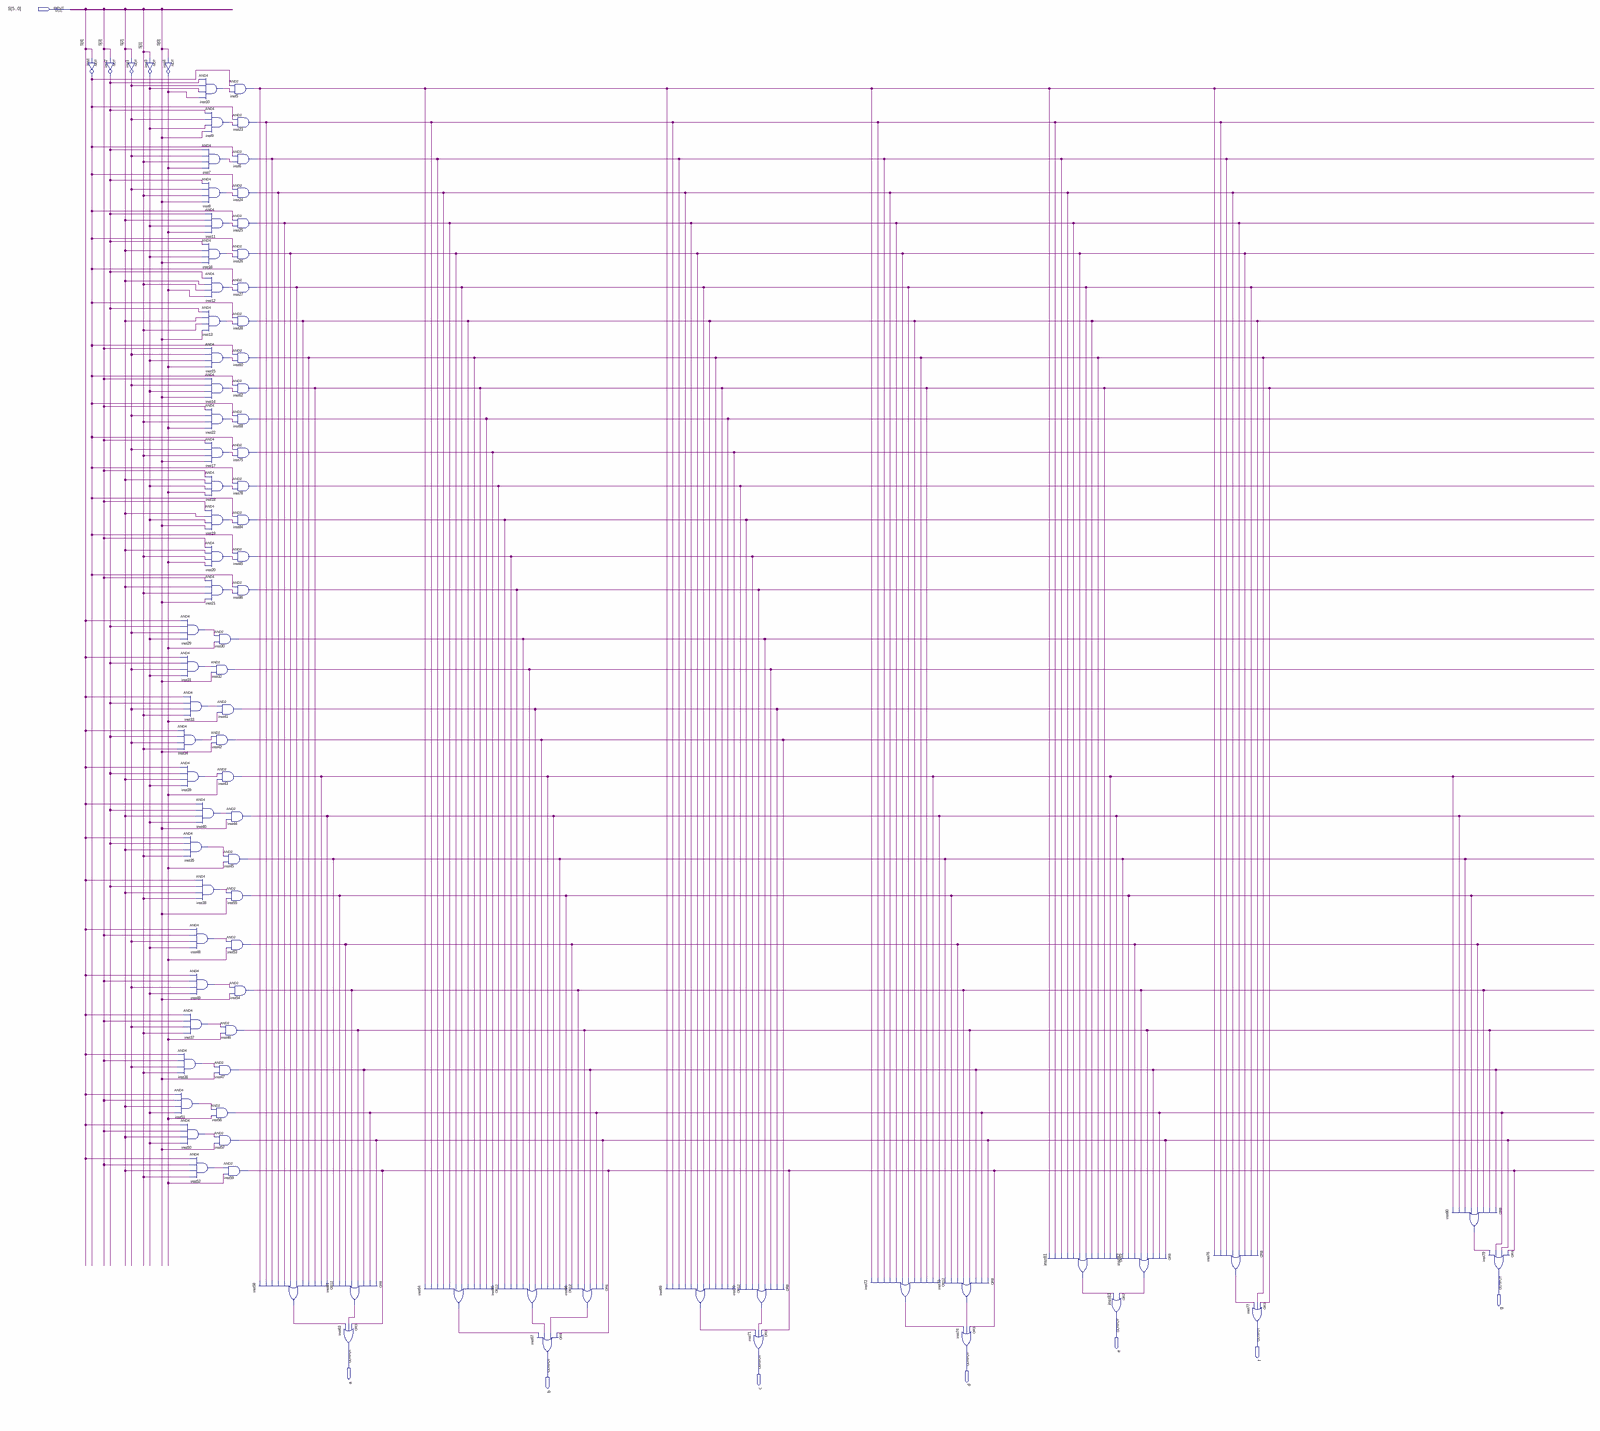
[diagram p0: schematic sheet, whole]
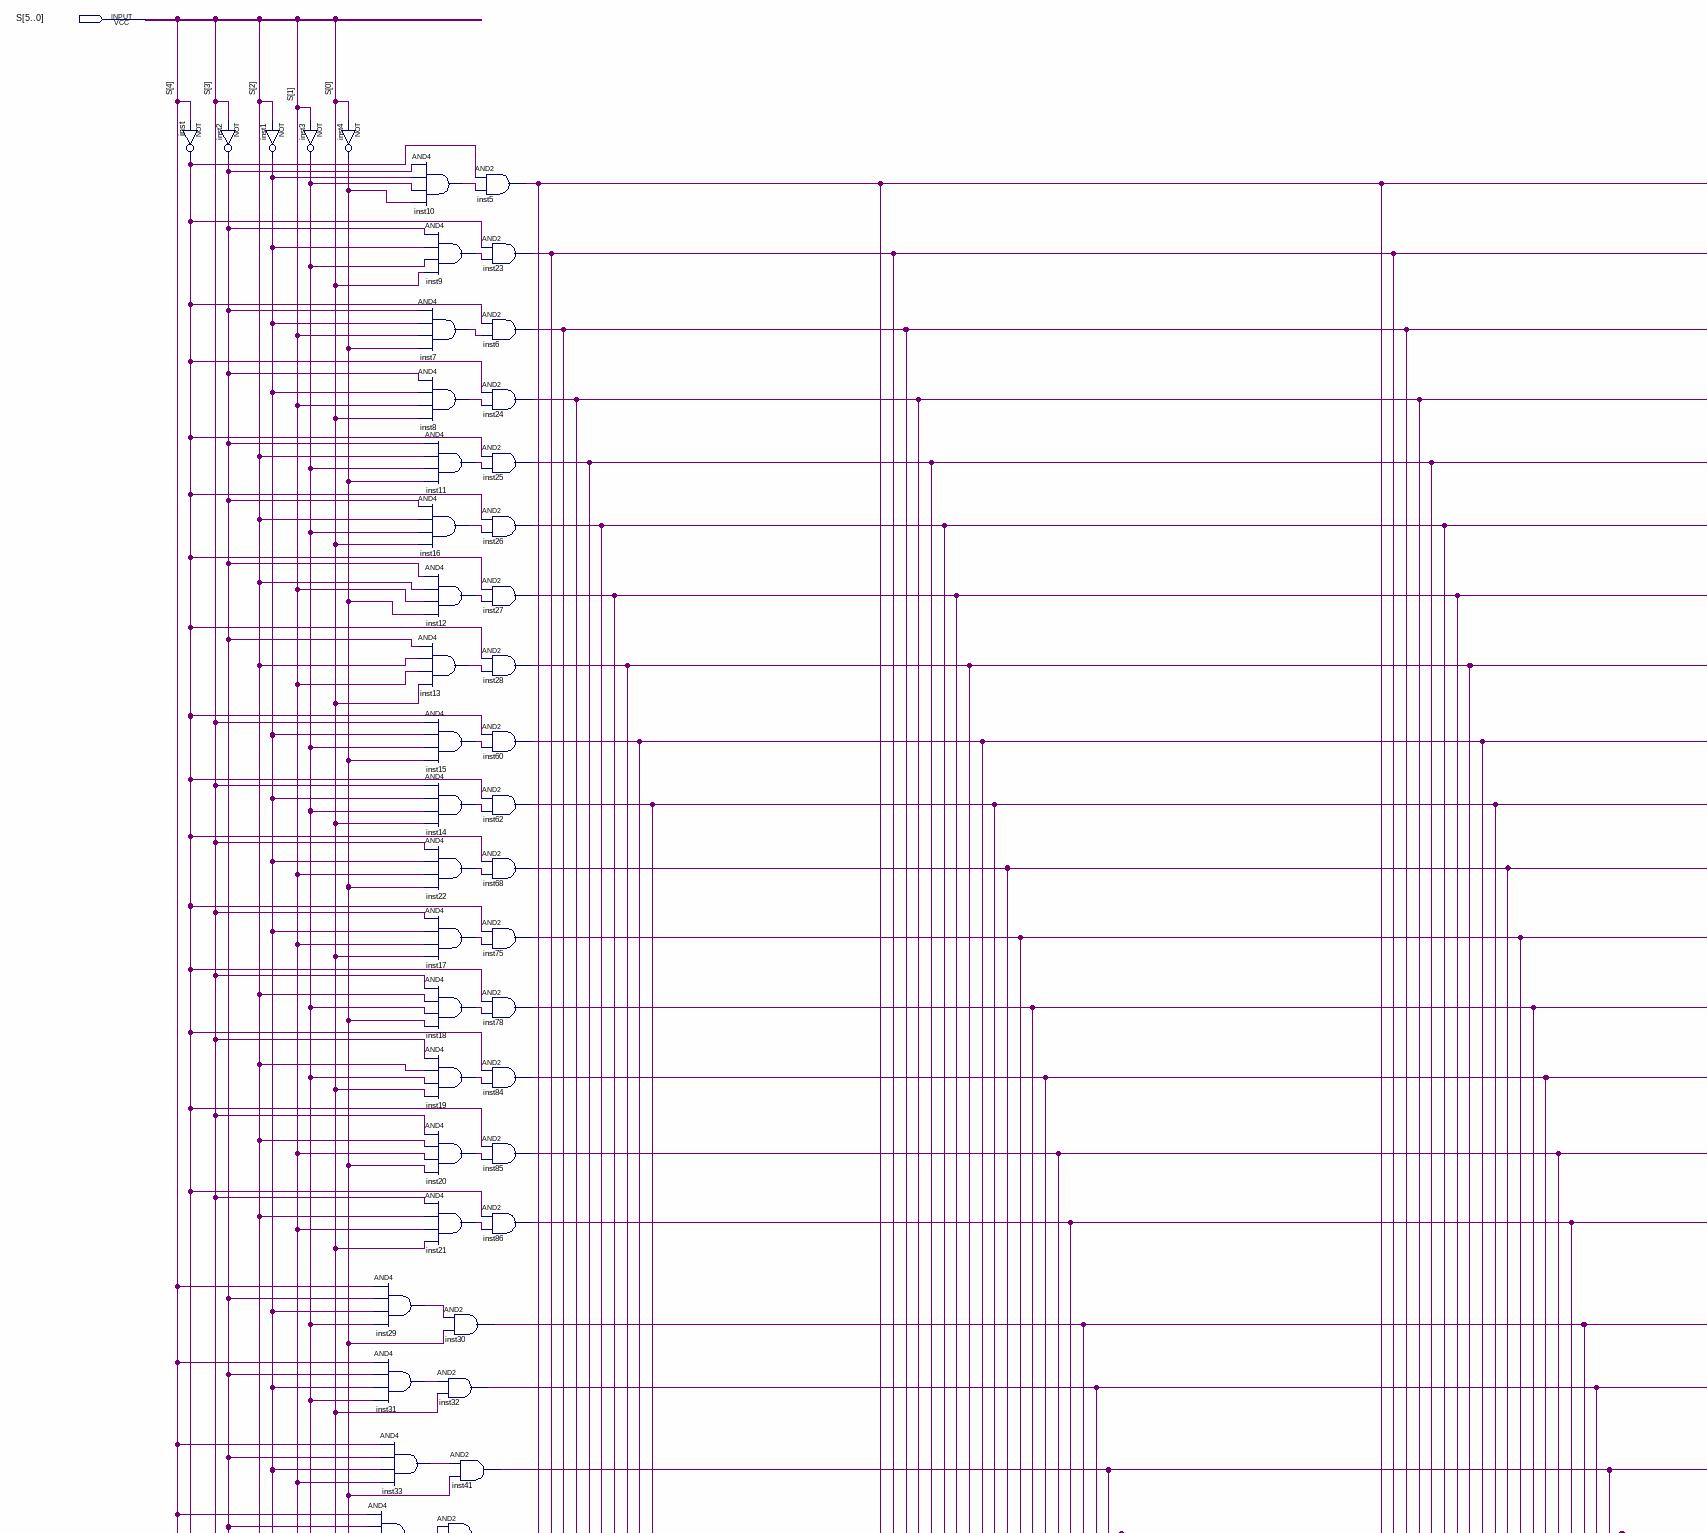
[diagram p1: schematic sheet, upper left part]
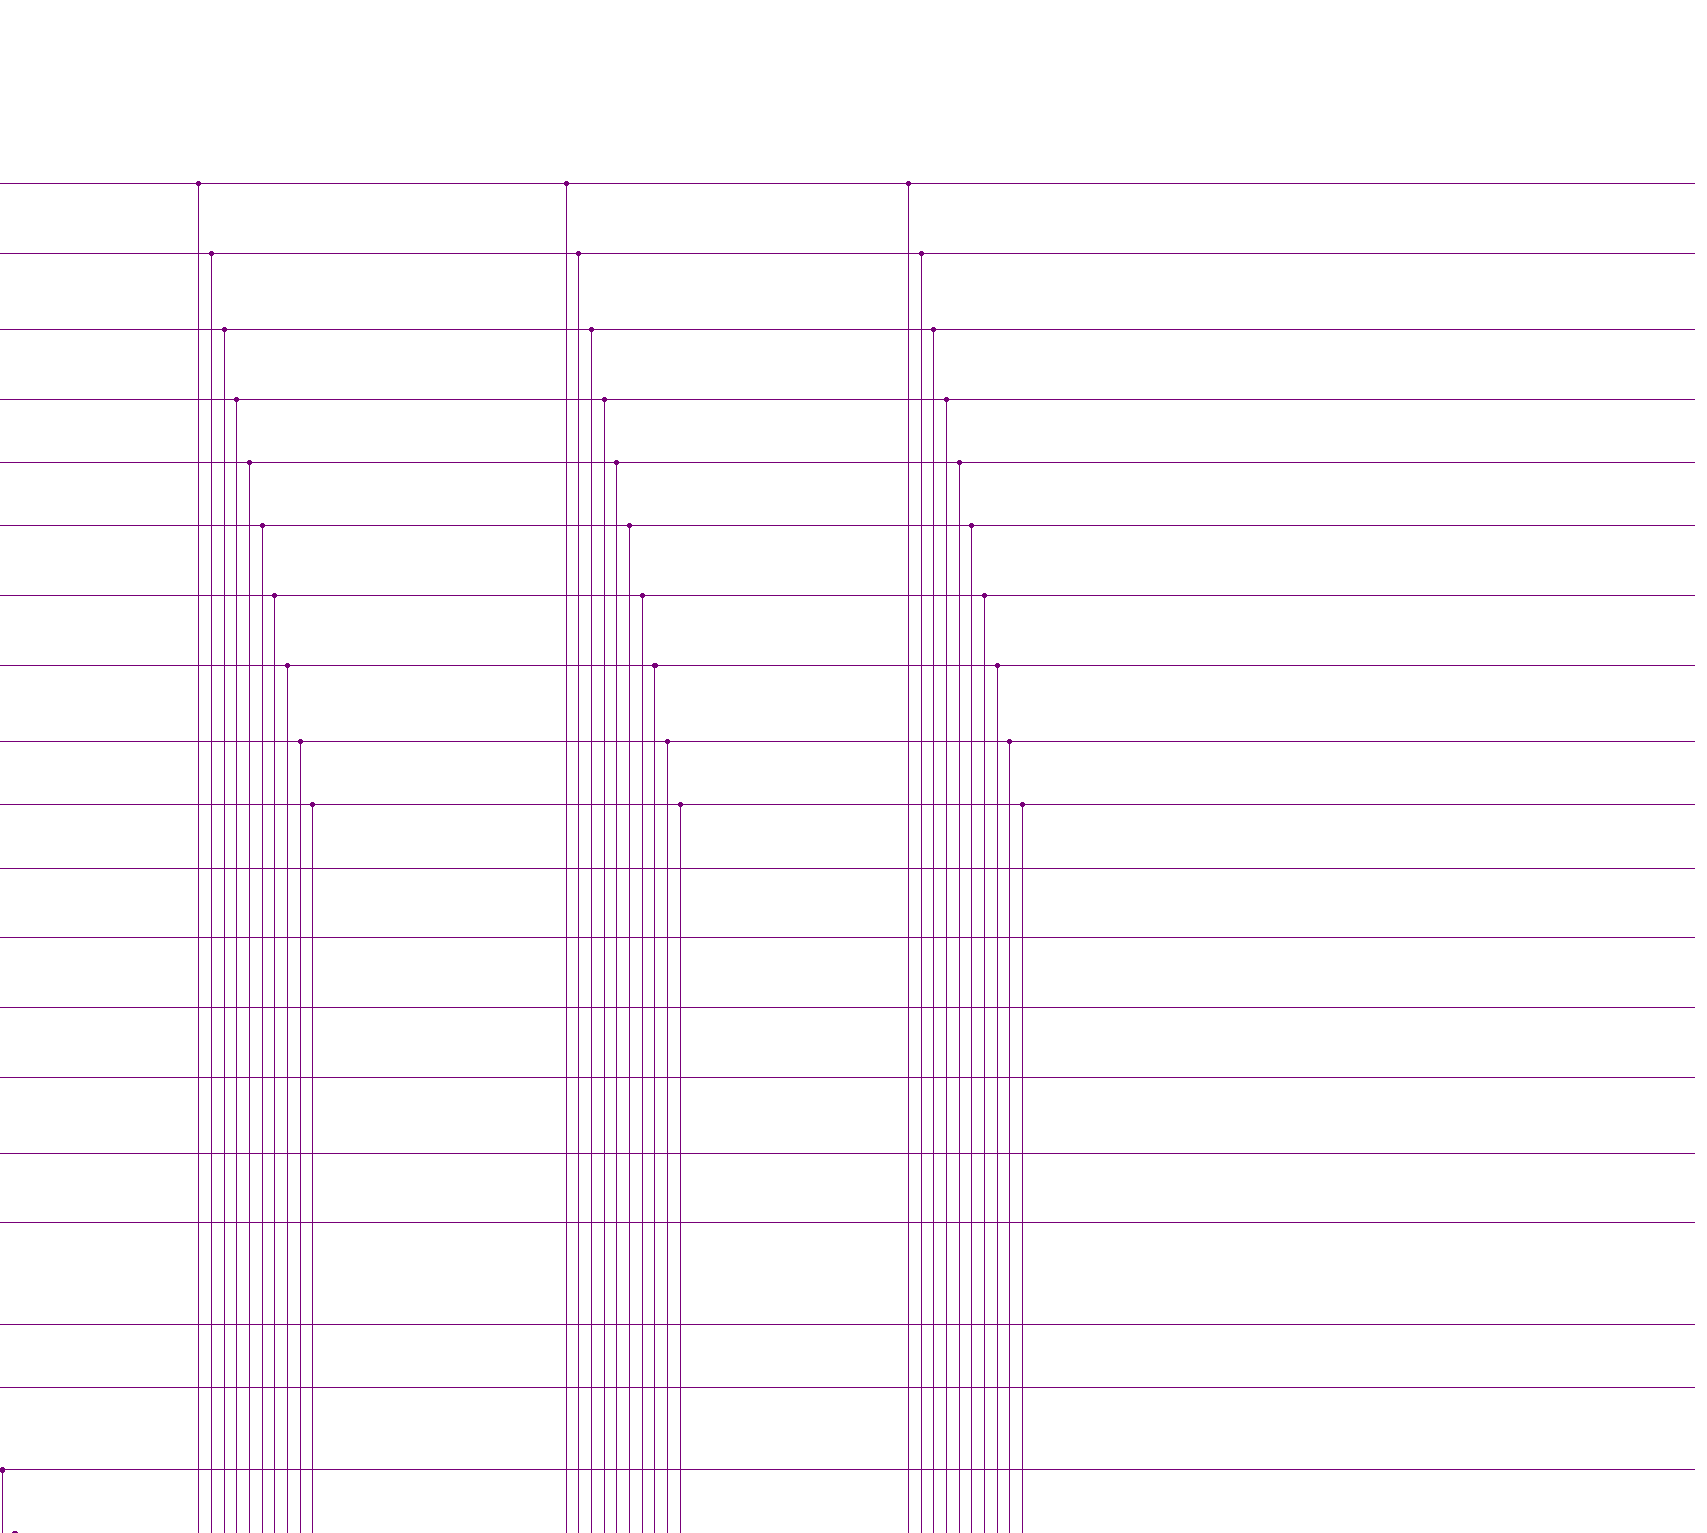
[diagram p2: schematic sheet, upper right part]
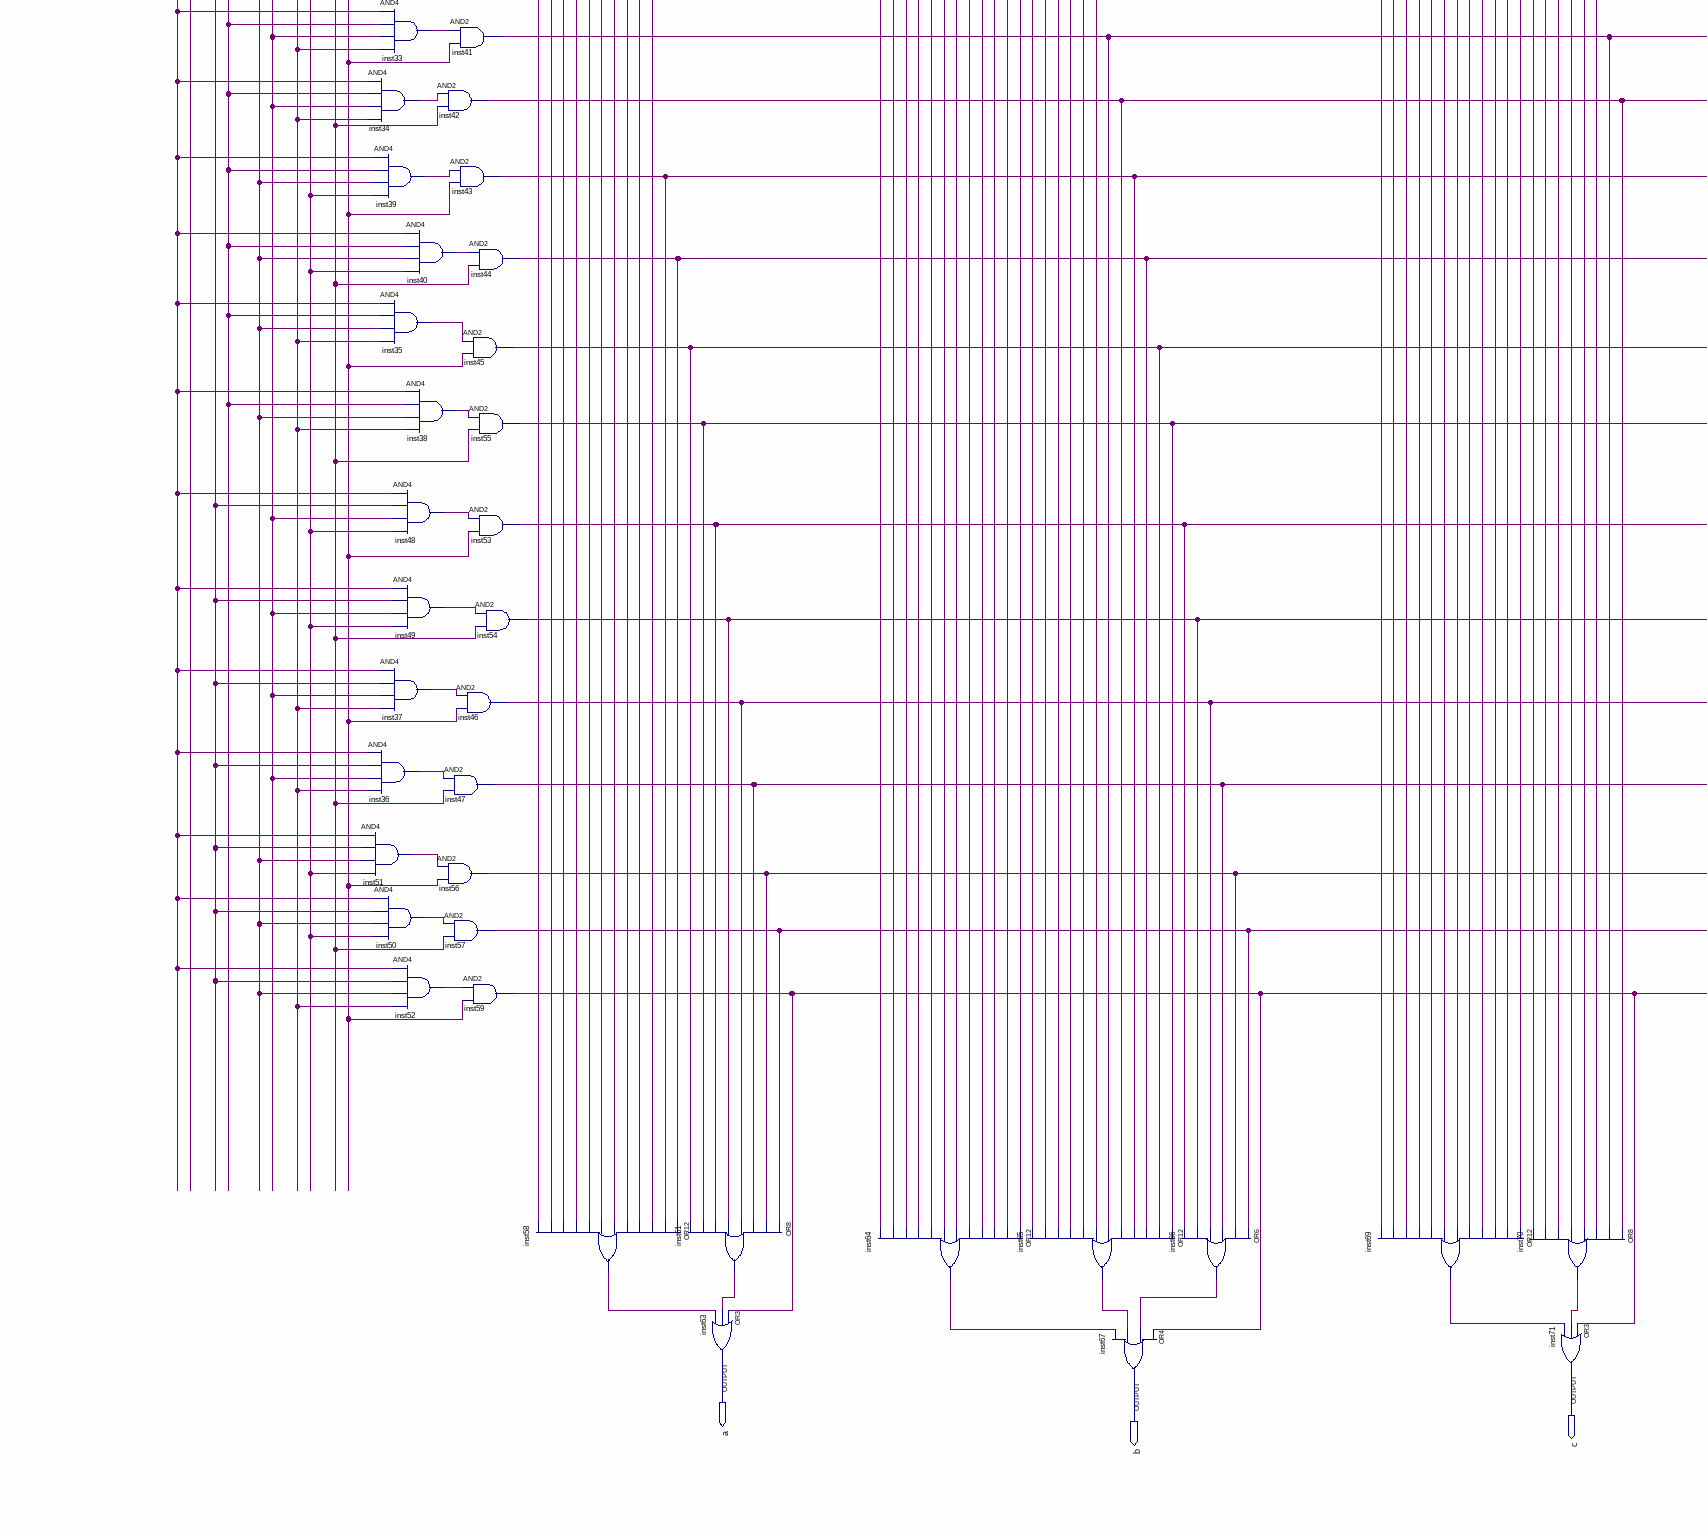
[diagram p3: schematic sheet, lower left part]
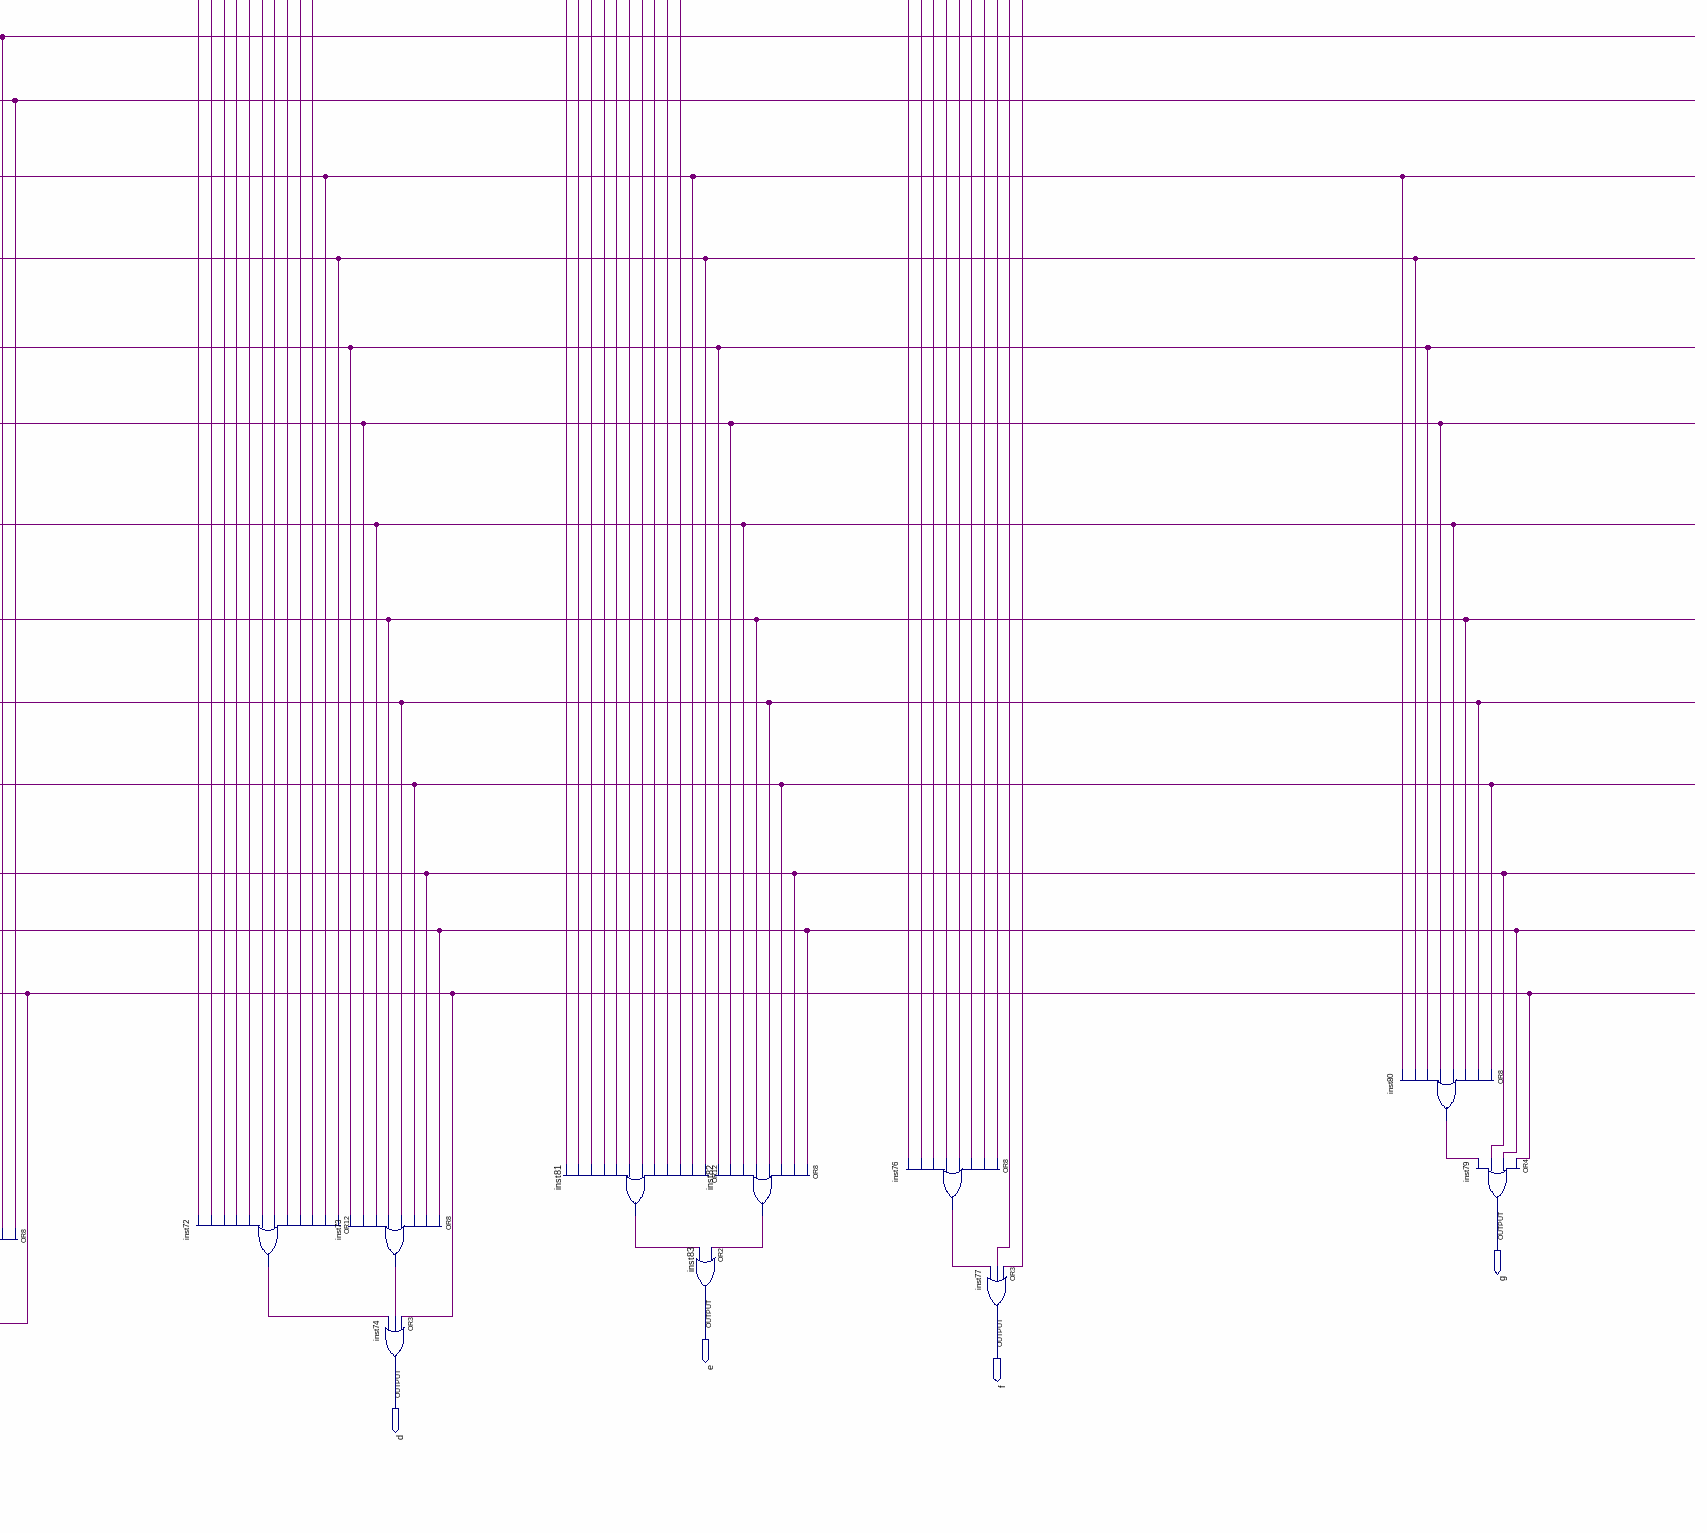
[diagram p4: schematic sheet, lower right part]
// Quartus schematic decodificadorEsquerdoOK.bdf as structural Verilog: 87 symbols, 8 pins
module decodificadorEsquerdoOK (
  input  [5:0] S,
  output g,
  output e,
  output f,
  output a,
  output d,
  output c,
  output b
);

  wire inst1_out, inst2_out, inst3_out, inst4_out, inst5_out, inst6_out, inst7_out, inst8_out, inst9_out,
       inst10_out, inst11_out, inst12_out, inst13_out, inst14_out, inst15_out, inst16_out, inst17_out,
       inst18_out, inst19_out, inst20_out, inst21_out, inst22_out, inst23_out, inst24_out, inst25_out,
       inst26_out, inst27_out, inst28_out, inst29_out, inst30_out, inst31_out, inst32_out, inst33_out,
       inst34_out, inst35_out, inst36_out, inst37_out, inst38_out, inst39_out, inst40_out, inst41_out,
       inst42_out, inst43_out, inst44_out, inst45_out, inst46_out, inst47_out, inst48_out, inst49_out,
       inst50_out, inst51_out, inst52_out, inst53_out, inst54_out, inst55_out, inst56_out, inst57_out,
       inst58_out, inst59_out, inst60_out, inst61_out, inst62_out, inst64_out, inst65_out, inst66_out,
       inst68_out, inst69_out, inst70_out, inst72_out, inst73_out, inst75_out, inst76_out, inst78_out,
       inst80_out, inst81_out, inst82_out, inst84_out, inst85_out, inst86_out, inst_out;

  not inst (inst_out, S[4]);
  not inst2 (inst2_out, S[3]);
  not inst1 (inst1_out, S[2]);
  not inst3 (inst3_out, S[1]);
  not inst4 (inst4_out, S[0]);
  and inst29 (inst29_out, S[4], inst2_out, inst1_out, inst3_out);
  and inst31 (inst31_out, S[4], inst2_out, inst1_out, inst3_out);
  and inst33 (inst33_out, S[4], inst2_out, inst1_out, S[1]);
  and inst34 (inst34_out, S[4], inst2_out, inst1_out, S[1]);
  and inst39 (inst39_out, S[4], inst2_out, S[2], inst3_out);
  and inst35 (inst35_out, S[4], inst2_out, S[2], S[1]);
  and inst48 (inst48_out, S[4], S[3], inst1_out, inst3_out);
  and inst49 (inst49_out, S[4], S[3], inst1_out, inst3_out);
  and inst37 (inst37_out, S[4], S[3], inst1_out, S[1]);
  and inst36 (inst36_out, S[4], S[3], inst1_out, S[1]);
  and inst51 (inst51_out, S[4], S[3], S[2], inst3_out);
  and inst50 (inst50_out, S[4], S[3], S[2], inst3_out);
  and inst52 (inst52_out, S[4], S[3], S[2], S[1]);
  and inst10 (inst10_out, inst2_out, inst1_out, inst3_out, inst4_out);
  and inst9 (inst9_out, inst2_out, inst1_out, inst3_out, S[0]);
  and inst7 (inst7_out, inst2_out, inst1_out, S[1], inst4_out);
  and inst8 (inst8_out, inst2_out, inst1_out, S[1], S[0]);
  and inst11 (inst11_out, inst2_out, S[2], inst3_out, inst4_out);
  and inst16 (inst16_out, inst2_out, S[2], inst3_out, S[0]);
  and inst12 (inst12_out, inst2_out, S[2], S[1], inst4_out);
  and inst13 (inst13_out, inst2_out, S[2], S[1], S[0]);
  and inst15 (inst15_out, S[3], inst1_out, inst3_out, inst4_out);
  and inst14 (inst14_out, S[3], inst1_out, inst3_out, S[0]);
  and inst22 (inst22_out, S[3], inst1_out, S[1], inst4_out);
  and inst17 (inst17_out, S[3], inst1_out, S[1], S[0]);
  and inst18 (inst18_out, S[3], S[2], inst3_out, inst4_out);
  and inst19 (inst19_out, S[3], S[2], inst3_out, S[0]);
  and inst20 (inst20_out, S[3], S[2], S[1], inst4_out);
  and inst21 (inst21_out, S[3], S[2], S[1], S[0]);
  and inst30 (inst30_out, inst29_out, inst4_out);
  and inst32 (inst32_out, inst31_out, S[0]);
  and inst42 (inst42_out, inst34_out, S[0]);
  and inst40 (inst40_out, S[4], inst2_out, S[2], inst3_out);
  and inst38 (inst38_out, S[4], inst2_out, S[2], S[1]);
  and inst47 (inst47_out, inst36_out, S[0]);
  and inst56 (inst56_out, inst51_out, inst4_out);
  and inst57 (inst57_out, inst50_out, S[0]);
  and inst5 (inst5_out, inst_out, inst10_out);
  and inst23 (inst23_out, inst_out, inst9_out);
  and inst6 (inst6_out, inst_out, inst7_out);
  and inst24 (inst24_out, inst_out, inst8_out);
  and inst25 (inst25_out, inst_out, inst11_out);
  and inst26 (inst26_out, inst_out, inst16_out);
  and inst27 (inst27_out, inst_out, inst12_out);
  and inst28 (inst28_out, inst_out, inst13_out);
  and inst60 (inst60_out, inst_out, inst15_out);
  and inst62 (inst62_out, inst_out, inst14_out);
  and inst68 (inst68_out, inst_out, inst22_out);
  and inst75 (inst75_out, inst_out, inst17_out);
  and inst78 (inst78_out, inst_out, inst18_out);
  and inst84 (inst84_out, inst_out, inst19_out);
  and inst85 (inst85_out, inst_out, inst20_out);
  and inst86 (inst86_out, inst_out, inst21_out);
  and inst41 (inst41_out, inst33_out, inst4_out);
  and inst43 (inst43_out, inst39_out, inst4_out);
  and inst44 (inst44_out, inst40_out, S[0]);
  and inst45 (inst45_out, inst35_out, inst4_out);
  and inst55 (inst55_out, inst38_out, S[0]);
  and inst53 (inst53_out, inst48_out, inst4_out);
  and inst54 (inst54_out, inst49_out, S[0]);
  and inst46 (inst46_out, inst37_out, inst4_out);
  and inst59 (inst59_out, inst52_out, inst4_out);
  or inst58 (inst58_out, inst44_out, inst43_out, inst62_out, inst60_out, inst28_out, inst27_out, inst26_out, inst25_out, inst24_out, inst6_out, inst23_out, inst5_out);
  or inst61 (inst61_out, inst57_out, inst56_out, inst47_out, inst46_out, inst54_out, inst53_out, inst55_out, inst45_out);
  or inst63 (a, inst59_out, inst61_out, inst58_out);
  or inst64 (inst64_out, inst75_out, inst68_out, inst62_out, inst60_out, inst28_out, inst27_out, inst26_out, inst25_out, inst24_out, inst6_out, inst23_out, inst5_out);
  or inst65 (inst65_out, inst55_out, inst45_out, inst44_out, inst43_out, inst42_out, inst41_out, inst32_out, inst30_out, inst86_out, inst85_out, inst84_out, inst78_out);
  or inst67 (b, inst59_out, inst66_out, inst65_out, inst64_out);
  or inst66 (inst66_out, inst57_out, inst56_out, inst47_out, inst46_out, inst54_out, inst53_out);
  or inst69 (inst69_out, inst75_out, inst68_out, inst62_out, inst60_out, inst28_out, inst27_out, inst26_out, inst25_out, inst24_out, inst6_out, inst23_out, inst5_out);
  or inst70 (inst70_out, inst42_out, inst41_out, inst32_out, inst30_out, inst86_out, inst85_out, inst84_out, inst78_out);
  or inst71 (c, inst59_out, inst70_out, inst69_out);
  or inst72 (inst72_out, inst44_out, inst43_out, inst62_out, inst60_out, inst28_out, inst27_out, inst26_out, inst25_out, inst24_out, inst6_out, inst23_out, inst5_out);
  or inst73 (inst73_out, inst57_out, inst56_out, inst47_out, inst46_out, inst54_out, inst53_out, inst55_out, inst45_out);
  or inst74 (d, inst59_out, inst73_out, inst72_out);
  or inst81 (inst81_out, inst44_out, inst43_out, inst62_out, inst60_out, inst28_out, inst27_out, inst26_out, inst25_out, inst24_out, inst6_out, inst23_out, inst5_out);
  or inst82 (inst82_out, inst57_out, inst56_out, inst47_out, inst46_out, inst54_out, inst53_out, inst55_out, inst45_out);
  or inst83 (e, inst82_out, inst81_out);
  or inst76 (inst76_out, inst28_out, inst27_out, inst26_out, inst25_out, inst24_out, inst6_out, inst23_out, inst5_out);
  or inst77 (f, inst62_out, inst60_out, inst76_out);
  or inst80 (inst80_out, inst47_out, inst46_out, inst54_out, inst53_out, inst55_out, inst45_out, inst44_out, inst43_out);
  or inst79 (g, inst59_out, inst57_out, inst56_out, inst80_out);
endmodule
